# Altium project PonteH.PrjPCB
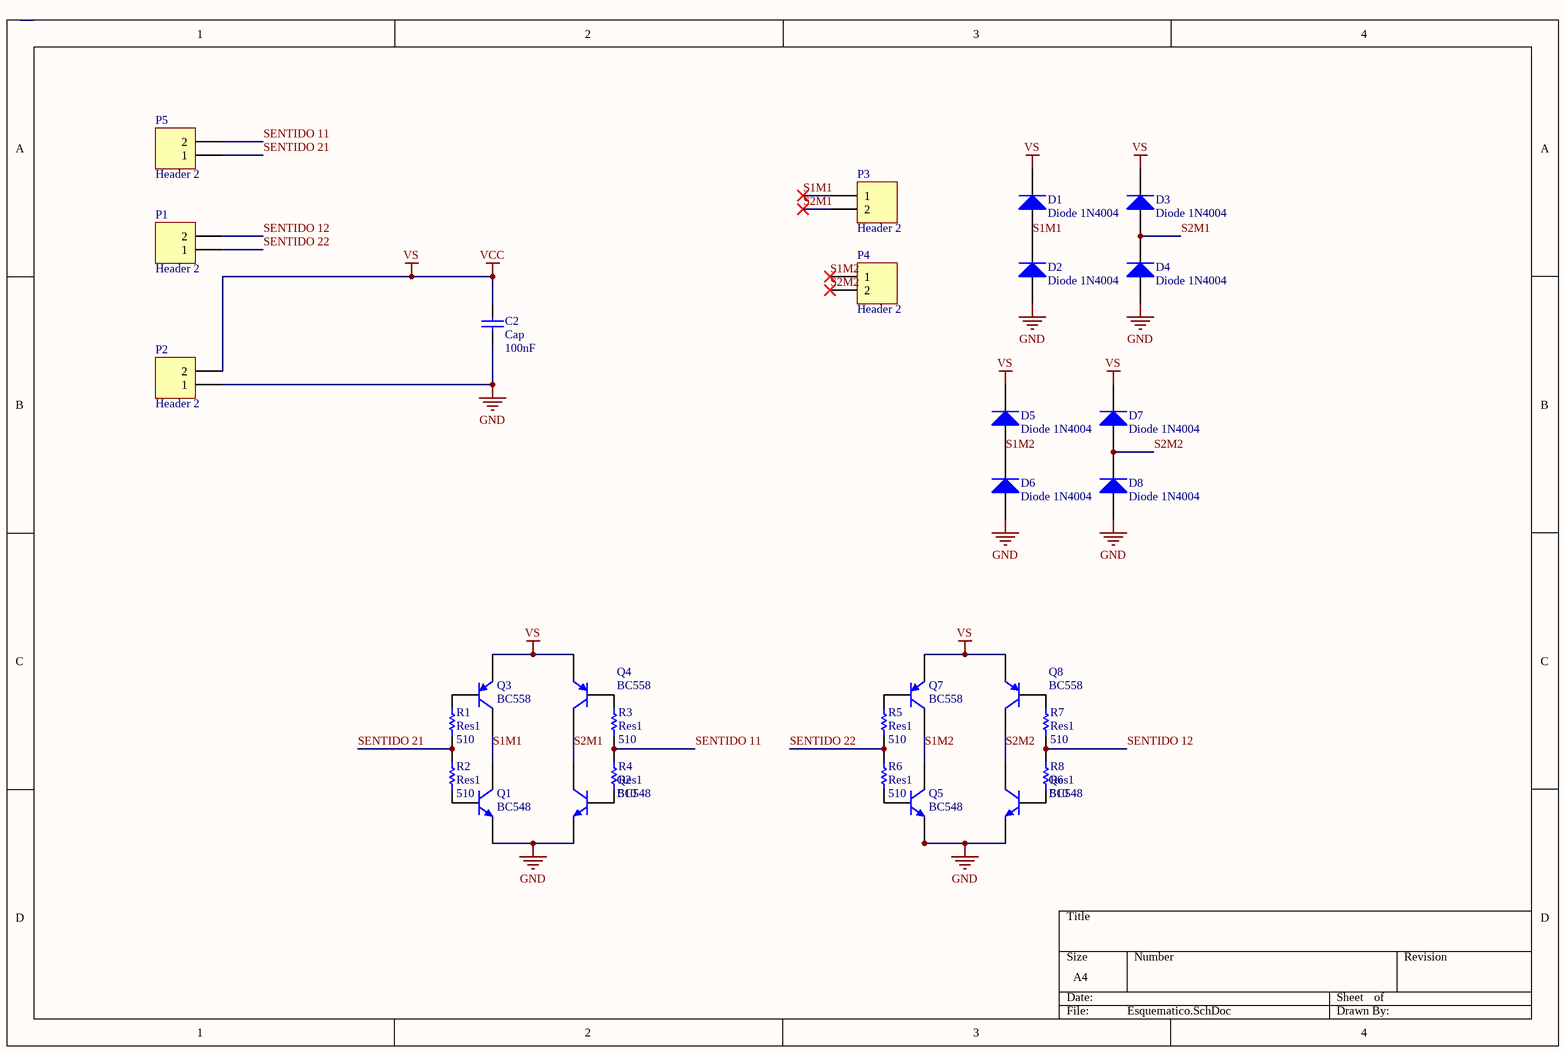
[diagram p0: Esquematico.SchDoc]
1 sheet, 30 parts. Net scope: global (net labels, ports and power ports of the same name join across sheets).
Board file: PCB.PcbDoc

## Sheet Esquematico.SchDoc
size A4

### Parts
C2  Cap  value 100nF  [RAD-0.1]
D1  Diode 1N4004  [DO-41]
D2  Diode 1N4004  [DO-41]
D3  Diode 1N4004  [DO-41]
D4  Diode 1N4004  [DO-41]
D5  Diode 1N4004  [DO-41]
D6  Diode 1N4004  [DO-41]
D7  Diode 1N4004  [DO-41]
D8  Diode 1N4004  [DO-41]
P1  Header 2  [HDR1X2]
P2  Header 2  [HDR1X2]
P3  Header 2  [HDR1X2]
P4  Header 2  [HDR1X2]
P5  Header 2  [HDR1X2]
Q1  BC548  [TO-92]
Q2  BC548  [TO-92]
Q3  BC558  [TO-92]
Q4  BC558  [TO-92]
Q5  BC548  [TO-92]
Q6  BC548  [TO-92]
Q7  BC558  [TO-92]
Q8  BC558  [TO-92]
R1  Res1  value 510  [AXIAL-0.3]
R2  Res1  value 510  [AXIAL-0.3]
R3  Res1  value 510  [AXIAL-0.3]
R4  Res1  value 510  [AXIAL-0.3]
R5  Res1  value 510  [AXIAL-0.3]
R6  Res1  value 510  [AXIAL-0.3]
R7  Res1  value 510  [AXIAL-0.3]
R8  Res1  value 510  [AXIAL-0.3]

### Nets
GND: C2.1 D2.1(A) D4.1(A) D6.1(A) D8.1(A) P2.1 Q1.1(E) Q2.1(E) Q5.1(E) Q6.1(E)
VCC: C2.2 D1.2(K) D3.2(K) D5.2(K) D7.2(K) P2.2 Q3.1(E) Q4.1(E) Q7.1(E) Q8.1(E)  [also labelled VS]
S1M1: D1.1(A) D2.2(K) P3.1 Q1.3(C) Q3.3(C)
S1M2: D5.1(A) D6.2(K) P4.1 Q5.3(C) Q7.3(C)
S2M1: D3.1(A) D4.2(K) P3.2 Q2.3(C) Q4.3(C)
S2M2: D7.1(A) D8.2(K) P4.2 Q6.3(C) Q8.3(C)
SENTIDO 11: P5.2 R3.1 R4.2
SENTIDO 12: P1.2 R7.1 R8.2
SENTIDO 21: P5.1 R1.1 R2.2
SENTIDO 22: P1.1 R5.1 R6.2
NetQ1_2: Q1.2(B) R2.1
NetQ2_2: Q2.2(B) R4.1
NetQ3_2: Q3.2(B) R1.2
NetQ4_2: Q4.2(B) R3.2
NetQ5_2: Q5.2(B) R6.1
NetQ6_2: Q6.2(B) R8.1
NetQ7_2: Q7.2(B) R5.2
NetQ8_2: Q8.2(B) R7.2

### Library data of the parts
C2 = Cap: Capacitor; Published: 8-Jun-2000; LatestRevisionDate: 17-Jul-2002; LatestRevisionNote: Re-released for DXP Platform.; PackageReference: RAD-0.3; Publisher: Altium Limited; PackageDescription: Radial Cap, Thru-Hole; 2 Leads; 0.3 in Pin Spacing
D1-D8 = Diode 1N4004: 1 Amp General Purpose Rectifier; Published: 8-Jun-2000; LatestRevisionDate: 17-Jul-2002; LatestRevisionNote: Re-released for DXP Platform.; DatasheetVersion: 1998; PackageVersion: Aug-1999; PackageReference: DO-41; Publisher: Altium Limited; PackageDescription: Diode, Axial; Body 5.2 x 2.7 mm (LxDia. max), Lead Dia. 0.86 mm (max); Code_JEDEC: DO-204-AL; ComponentLink1Description: Manufacturer Link; ComponentLink1URL: http://www.fairchildsemi.com/; ComponentLink2Description: Datasheet; ComponentLink2URL: http://www.fairchildsemi.com/ds/1N%2F1N4001.pdf
P1-P5 = Header 2: Header, 2-Pin; LatestRevisionDate: 17-Jul-2002; LatestRevisionNote: Re-released for DXP Platform.; Publisher: Altium Limited
Q1 Q2 Q5 Q6 = BC548: NPN General Purpose Amplifier; Published: 8-Jun-2000; LatestRevisionDate: 15-Jan-2003; LatestRevisionNote: PCB Footprint 'BCY-W3/D4.7' replaced; DatasheetVersion: 1997; PackageVersion: Sep-1998; PackageReference: TO-92A; Publisher: Altium Limited; PackageDescription: TO, Flat Index; 3 In-Line, Axial Leads; Body Dia. 4.5mm; Leads 0.51 x 0.48 mm (max); ComponentLink1Description: Manufacturer Link; ComponentLink1URL: http://www.fairchildsemi.com/; ComponentLink2Description: Datasheet; ComponentLink2URL: http://www.fairchildsemi.com/ds/2N%2F2N3904.pdf
Q3 Q4 Q7 Q8 = BC558: PNP Bipolar Transistor; Published: 8-Jun-2000; LatestRevisionDate: 29-May-2009; LatestRevisionNote: IPC-7351 Footprint Added.; PackageVersion: Aug-1999; PackageReference: SOT-23B; Publisher: Altium Limited; PackageDescription: 3-Pin SOT-23 Package 0.95 mm Pitch, 2.4 mm Lead Span
R1-R8 = Res1: Resistor; Published: 8-Jun-2000; LatestRevisionDate: 17-Jul-2002; LatestRevisionNote: Re-released for DXP Platform.; PackageReference: AXIAL-0.3; Publisher: Altium Limited; PackageDescription: Axial Device, Thru-Hole; 2 Leads; 0.3 in Pin Spacing